# EAGLE design SNARFBASE-v03i-new232 (EAGLE 5.11)
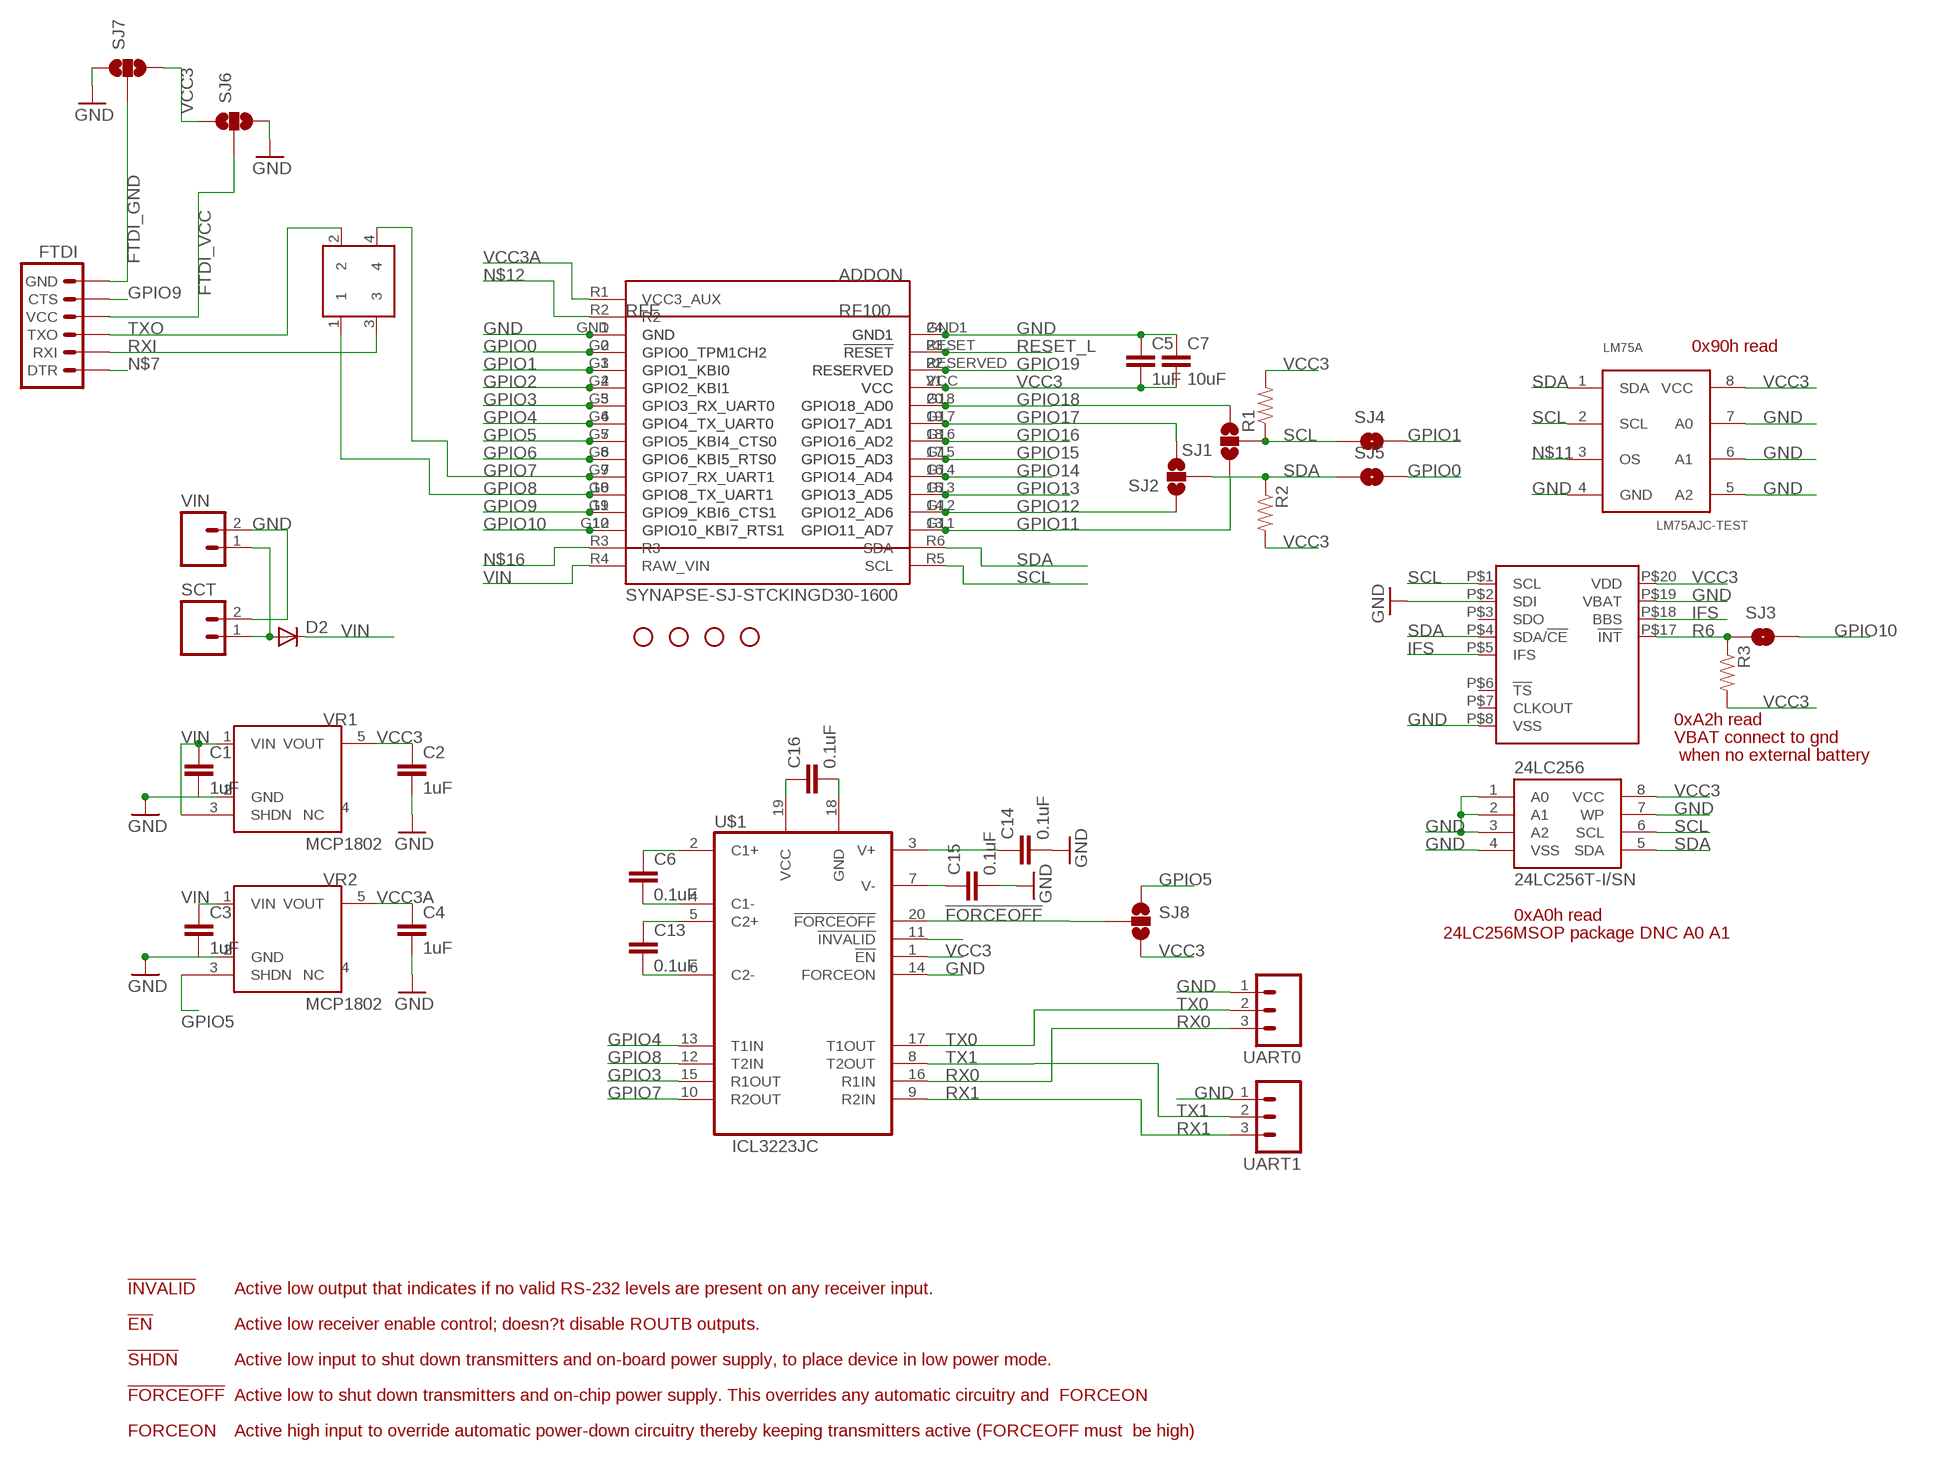
[diagram p0: schematic, sheet 1]

## Parts
24LC256  24LC256T-I/SN  EEPROM-I2CSMD  [SO08]
ADDON  SYNAPSE-SJ-STCKINGD30-1600  [SYNSJ-STACK]
C1  1uF  CAP0805  [0805]
C2  1uF  CAP0805  [0805]
C3  1uF  CAP0805  [0805]
C4  1uF  CAP0805  [0805]
C5  1uF  CAP0805  [0805]
C6  0.1uF  CAP0805  [0805]
C7  10uF  CAP0805  [0805]
C13  0.1uF  CAP0805  [0805]
C14  0.1uF  CAP0805  [0805]
C15  0.1uF  CAP0805  [0805]
C16  0.1uF  CAP0805  [0805]
D2  DIODESMA  [SMA-DIODE]
FTDI  ARDUINO_SERIAL_PROGRAMPTH  [1X06]
JP6  STAND-OFF  [STAND-OFF]
JP9  STAND-OFF  [STAND-OFF]
JP10  STAND-OFF  [STAND-OFF]
JP11  STAND-OFF  [STAND-OFF]
LM75A  LM75AJC-TEST  [TSSOP8-3MM]
PCF2129A  PCF2129ASO20  [SO20W]
R1  RESISTOR  [0805]
R2  RESISTOR  [0805]
R3  RESISTOR  [0805]
RFE  RFE  RF100-JACKJACK2  [SYNAPSERFENGINE-THM-SMT-JACK2]
RXTX  SERIAL_CROSSOVER  [2X02_PTH]
SCT  M023.5MM  [SCREWTERMINAL-3.5MM-2]
SJ1  SOLDERJUMPER_2WAYS  [SJ_3]
SJ2  SOLDERJUMPER_2WAYS  [SJ_3]
SJ3  SOLDERJUMPERNC2  [SJ_2S-NOTRACE]
SJ4  SOLDERJUMPERNO  [SJ_2S-NO]
SJ5  SOLDERJUMPERNO  [SJ_2S-NO]
SJ6  SOLDERJUMPER_2WAYPASTE1&2  [SJ_3_PASTE1&2]
SJ7  SOLDERJUMPER_2WAYPASTE1&2  [SJ_3_PASTE1&2]
SJ8  SOLDERJUMPER_2WAYPASTE1&2  [SJ_3_PASTE1&2]
U$1  ICL3223JC  [TSSOP20-JC]
UART0  M03PTH  [1X03]
UART1  M03PTH  [1X03]
VIN  M02PTH  [1X02]
VR1  MCP1802  [SOT23-5]
VR2  MCP1802  [SOT23-5]

## Nets
!FORCEOFF: SJ8.2 U$1.20(!FORCEOFF)
FTDI_GND: FTDI.6(GND) SJ7.2
FTDI_VCC: FTDI.4(VCC) SJ6.2
GND: 24LC256.1(A0) 24LC256.2(A1) 24LC256.3(A2) 24LC256.4(VSS) 24LC256.7(WP) ADDON.GND ADDON.GND1 C1.2 C2.2 C3.2 C4.2 C5.1 C7.1 C14.2 C15.2 C16.2 LM75A.4(GND) LM75A.5(A2) LM75A.6(A1) LM75A.7(A0) PCF2129A.P$2(SDI) PCF2129A.P$8(VSS) PCF2129A.P$19(VBAT) RFE.1(GND) RFE.24(GND1) RFE.P1 RFE.P24 RFE.P201 RFE.P224 SCT.2 SJ6.3 SJ7.1 U$1.14(FORCEON) U$1.18(GND) UART0.1 UART1.1 VIN.2 VR1.2(GND) VR2.2(GND)
GPIO0: ADDON.G0(GPIO0_TPM1CH2) RFE.2(GPIO0_TPM1CH2) RFE.P2 RFE.P202 SJ5.2
GPIO1: ADDON.G1(GPIO1_KBI0) RFE.3(GPIO1_KBI0) RFE.P3 RFE.P203 SJ4.2
GPIO2: ADDON.G2(GPIO2_KBI1) RFE.4(GPIO2_KBI1) RFE.P4 RFE.P204
GPIO3: ADDON.G3(GPIO3_RX_UART0) RFE.5(GPIO3_RX_UART0) RFE.P5 RFE.P205 U$1.15(R1OUT)
GPIO4: ADDON.G4(GPIO4_TX_UART0) RFE.6(GPIO4_TX_UART0) RFE.P6 RFE.P206 U$1.13(T1IN)
GPIO5: ADDON.G5(GPIO5_KBI4_CTS0) RFE.7(GPIO5_KBI4_CTS0) RFE.P7 RFE.P207 SJ8.1 VR2.3(SHDN)
GPIO6: ADDON.G6(GPIO6_KBI5_RTS0) RFE.8(GPIO6_KBI5_RTS0) RFE.P8 RFE.P208
GPIO7: ADDON.G7(GPIO7_RX_UART1) RFE.9(GPIO7_RX_UART1) RFE.P9 RFE.P209 RXTX.4 U$1.10(R2OUT)
GPIO8: ADDON.G8(GPIO8_TX_UART1) RFE.10(GPIO8_TX_UART1) RFE.P10 RFE.P210 RXTX.1 U$1.12(T2IN)
GPIO9: ADDON.G9(GPIO9_KBI6_CTS1) FTDI.5(CTS) RFE.11(GPIO9_KBI6_CTS1) RFE.P11 RFE.P211
GPIO10: ADDON.G10(GPIO10_KBI7_RTS1) RFE.12(GPIO10_KBI7_RTS1) RFE.P12 RFE.P212 SJ3.2
GPIO11: ADDON.G11(GPIO11_AD7) RFE.13(GPIO11_AD7) RFE.P13 RFE.P213 SJ1.1
GPIO12: ADDON.G12(GPIO12_AD6) RFE.14(GPIO12_AD6) RFE.P14 RFE.P214 SJ2.1
GPIO13: ADDON.G13(GPIO13_AD5) RFE.15(GPIO13_AD5) RFE.P15 RFE.P215
GPIO14: ADDON.G14(GPIO14_AD4) RFE.16(GPIO14_AD4) RFE.P16 RFE.P216
GPIO15: ADDON.G15(GPIO15_AD3) RFE.17(GPIO15_AD3) RFE.P17 RFE.P217
GPIO16: ADDON.G16(GPIO16_AD2) RFE.18(GPIO16_AD2) RFE.P18 RFE.P218
GPIO17: ADDON.G17(GPIO17_AD1) RFE.19(GPIO17_AD1) RFE.P19 RFE.P219 SJ2.3
GPIO18: ADDON.G18(GPIO18_AD0) RFE.20(GPIO18_AD0) RFE.P20 RFE.P220 SJ1.3
GPIO19: ADDON.RESERVED RFE.22(RESERVED) RFE.P22 RFE.P222
IFS: PCF2129A.P$5(IFS) PCF2129A.P$18(BBS)
N$1: C13.1 U$1.5(C2+)
N$2: C13.2 U$1.6(C2-)
N$3: C6.1 U$1.2(C1+)
N$5: C6.2 U$1.4(C1-)
N$7: FTDI.1(DTR)
N$9: C14.1 U$1.3(V+)
N$10: C15.1 U$1.7(V-)
N$11: LM75A.3(OS)
N$12: ADDON.R2
N$16: ADDON.R3
N$20: U$1.11(!INVALID)
R6: PCF2129A.P$17(!INT) R3.1 SJ3.1
RESET_L: ADDON.RESET(!RESET) RFE.23(!RESET) RFE.P23 RFE.P223
RX0: UART0.3
RX1: U$1.9(R2IN) UART1.3
RXI: FTDI.2(RXI) RXTX.3
SCL: 24LC256.6(SCL) ADDON.R5(SCL) LM75A.2(SCL) PCF2129A.P$1(SCL) R1.1 SJ1.2 SJ4.1
SDA: 24LC256.5(SDA) ADDON.R6(SDA) LM75A.1(SDA) PCF2129A.P$4(SDA/!CE) R2.1 SJ2.2 SJ5.1
TX0: U$1.17(T1OUT) UART0.2
TX1: UART1.2
TXO: FTDI.3(TXO) RXTX.2
VCC3: 24LC256.8(VCC) ADDON.VCC C2.1 C5.2 C7.2 C16.1 LM75A.8(VCC) PCF2129A.P$20(VDD) R1.2 R2.2 R3.2 RFE.21(VCC) RFE.P21 RFE.P221 SJ6.1 SJ7.3 SJ8.3 U$1.1(!EN) U$1.19(VCC) VR1.5(VOUT)
VCC3A: ADDON.R1(VCC3_AUX) C4.1 VR2.5(VOUT)
VIN: ADDON.R4(RAW_VIN) C1.1 C3.1 D2.C VR1.1(VIN) VR1.3(SHDN) VR2.1(VIN)
VIN_PREDIODE: D2.A SCT.1 VIN.1
Unconnected: PCF2129A.P$3(SDO) PCF2129A.P$6(!TS) PCF2129A.P$7(CLKOUT) U$1.8(T2OUT) U$1.16(R1IN) VR1.4(NC) VR2.4(NC)

## Notes on the sheet
- 0x90h read
- 0xA2h read
- VBAT connect to gnd
- when no external battery
- 0xA0h read
- 24LC256MSOP package DNC A0 A1
- !INVALID | Active low output that indicates if no valid RS-232 levels are present on any receiver input.
- !EN | Active low receiver enable control; doesn?t disable ROUTB outputs.
- !SHDN | Active low input to shut down transmitters and on-board power supply, to place device in low power mode.
- !FORCEOFF | Active low to shut down transmitters and on-chip power supply. This overrides any automatic circuitry and  FORCEON
- FORCEON | Active high input to override automatic power-down circuitry thereby keeping transmitters active (FORCEOFF must  be high)

## Library data of the parts
24LC256 = SparkFun:EEPROM-I2C
ADDON = 0_jc-custom:SYNAPSE-SJ-STCKING: Standard layout for expansion modules using Synapse Wireless boards
C1-C7 C13-C16 = 0_jc-custom:CAP: Capacitor Standard 0603 ceramic capacitor, and 0.1" leaded capacitor.
D2 = SparkFun:DIODE: Diode These are standard reverse protection diodes and small signal diodes. SMA package can handle up to about 1A. SOD-323 can handle about 200mA. What the SOD-323 package when ordering, there are some mfgs out there that are 5-pin packages.
FTDI = SparkFun:ARDUINO_SERIAL_PROGRAM
JP6 JP9-JP11 = SparkFun:STAND-OFF: Stand Off This is the mechanical footprint for a #4 phillips button head screw. Use the keepout ring to avoid running the screw head into surrounding components. SKU : PRT-00447
LM75A = 0_jc-custom:LM75A
PCF2129A = 0_jc-custom:PCF2129A
R1-R3 = SparkFun:RESISTOR: Resistor Basic schematic elements and footprints for 0603, 1206, and PTH 1/10th watt (small) resistors.
RFE = 0_jc-custom:RF100-JACK
RXTX = 0_jc-custom:SERIAL_CROSSOVER
SCT VIN = SparkFun:M02: Header 2 Standard 2-pin 0.1" header. Use with straight break away headers (SKU : PRT-00116), right angle break away headers (PRT-00553), swiss pins (PRT-00743), machine pins (PRT-00117), and female headers (PRT-00115). Molex polarized connector foot print use with SKU : PRT-08233 with associated crimp pins and housings.
SJ1 SJ2 SJ6-SJ8 = SparkFun:SOLDERJUMPER_2WAY: Solder Jumper 2 way solder jumper
SJ3-SJ5 = SparkFun:SOLDERJUMPER: Solder Jumper Standard SMD solder jumper. Used to automate production. Two varients : Normally Open and Normally Closed are the same, but have different paste layers. NC will have a large amount of paste and should jumper during reflow.
U$1 = 0_jc-custom:ICL3223
UART0 UART1 = SparkFun:M03: Header 3 Standard 3-pin 0.1" header. Use with straight break away headers (SKU : PRT-00116), right angle break away headers (PRT-00553), swiss pins (PRT-00743), machine pins (PRT-00117), and female headers (PRT-00115). Molex polarized connector foot print use with SKU : PRT-08232 with associated crimp pins and housings.
VR1 VR2 = 0_jc-custom:MCP1802

## Net classes
0 default: width 0.254 mm
1 Power: width 0.508 mm
2 smallsignal: width 0.152 mm
3 stdsignal: width 0.254 mm

## Board
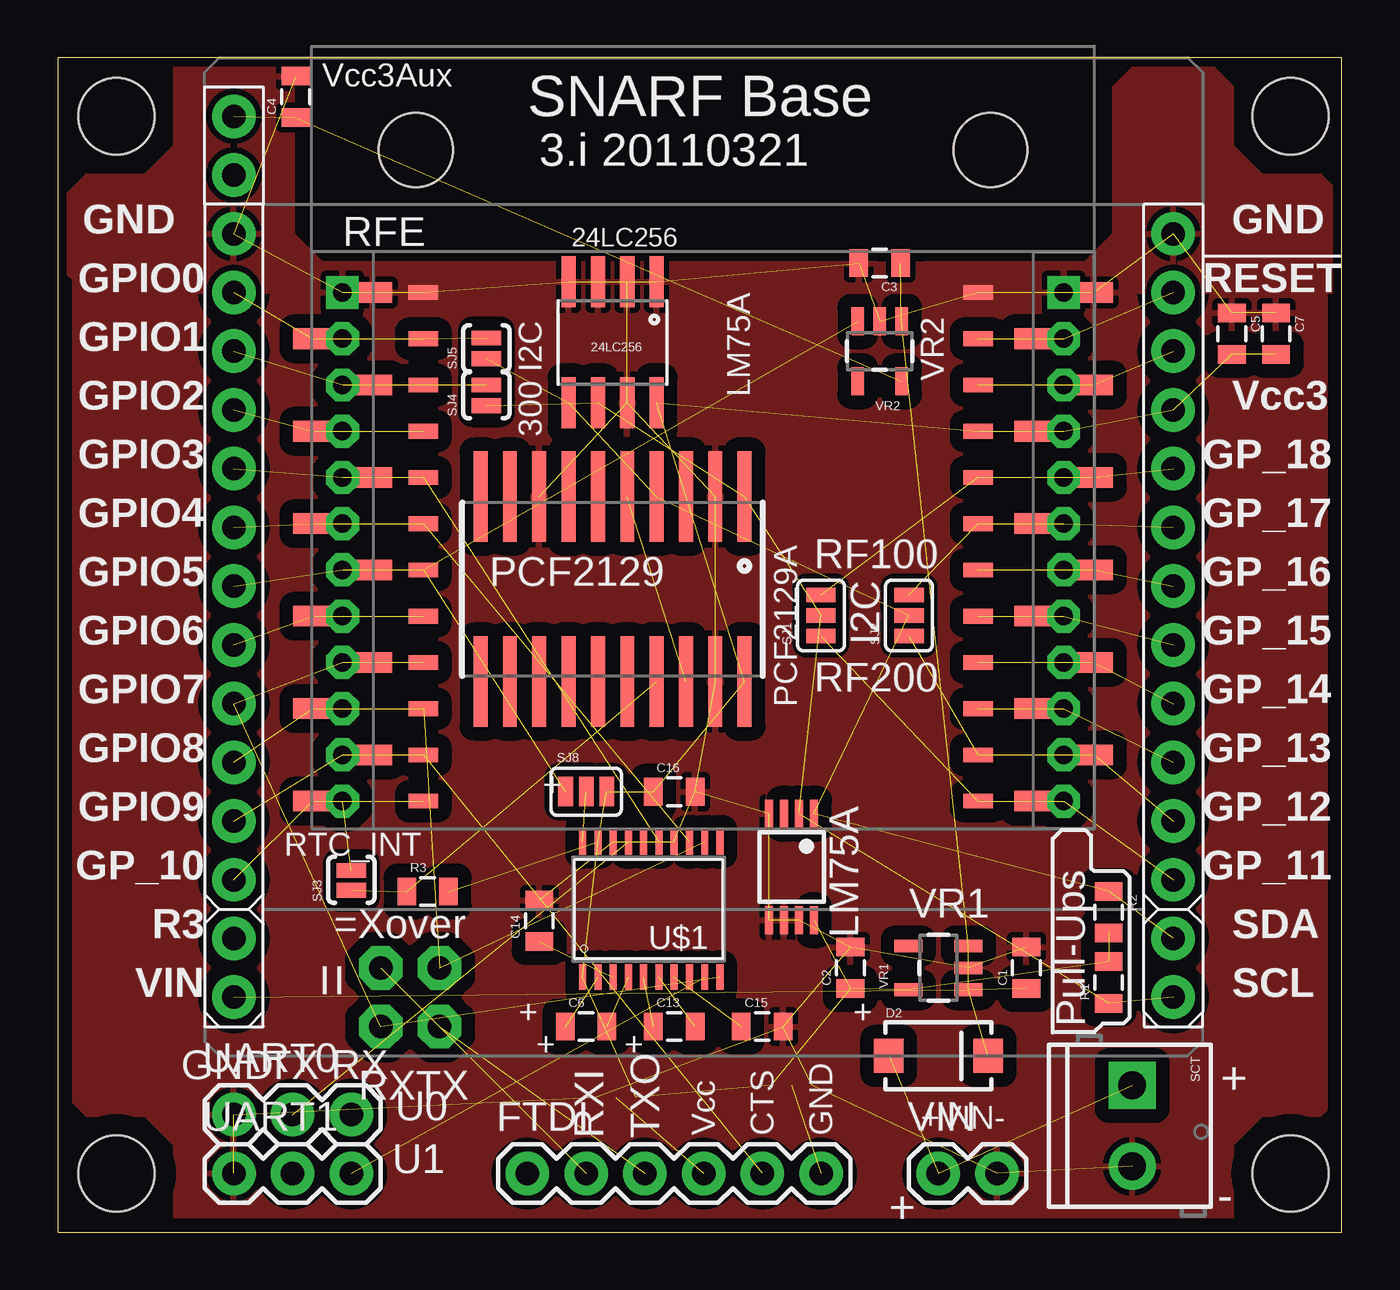
[diagram p1: board, top side]
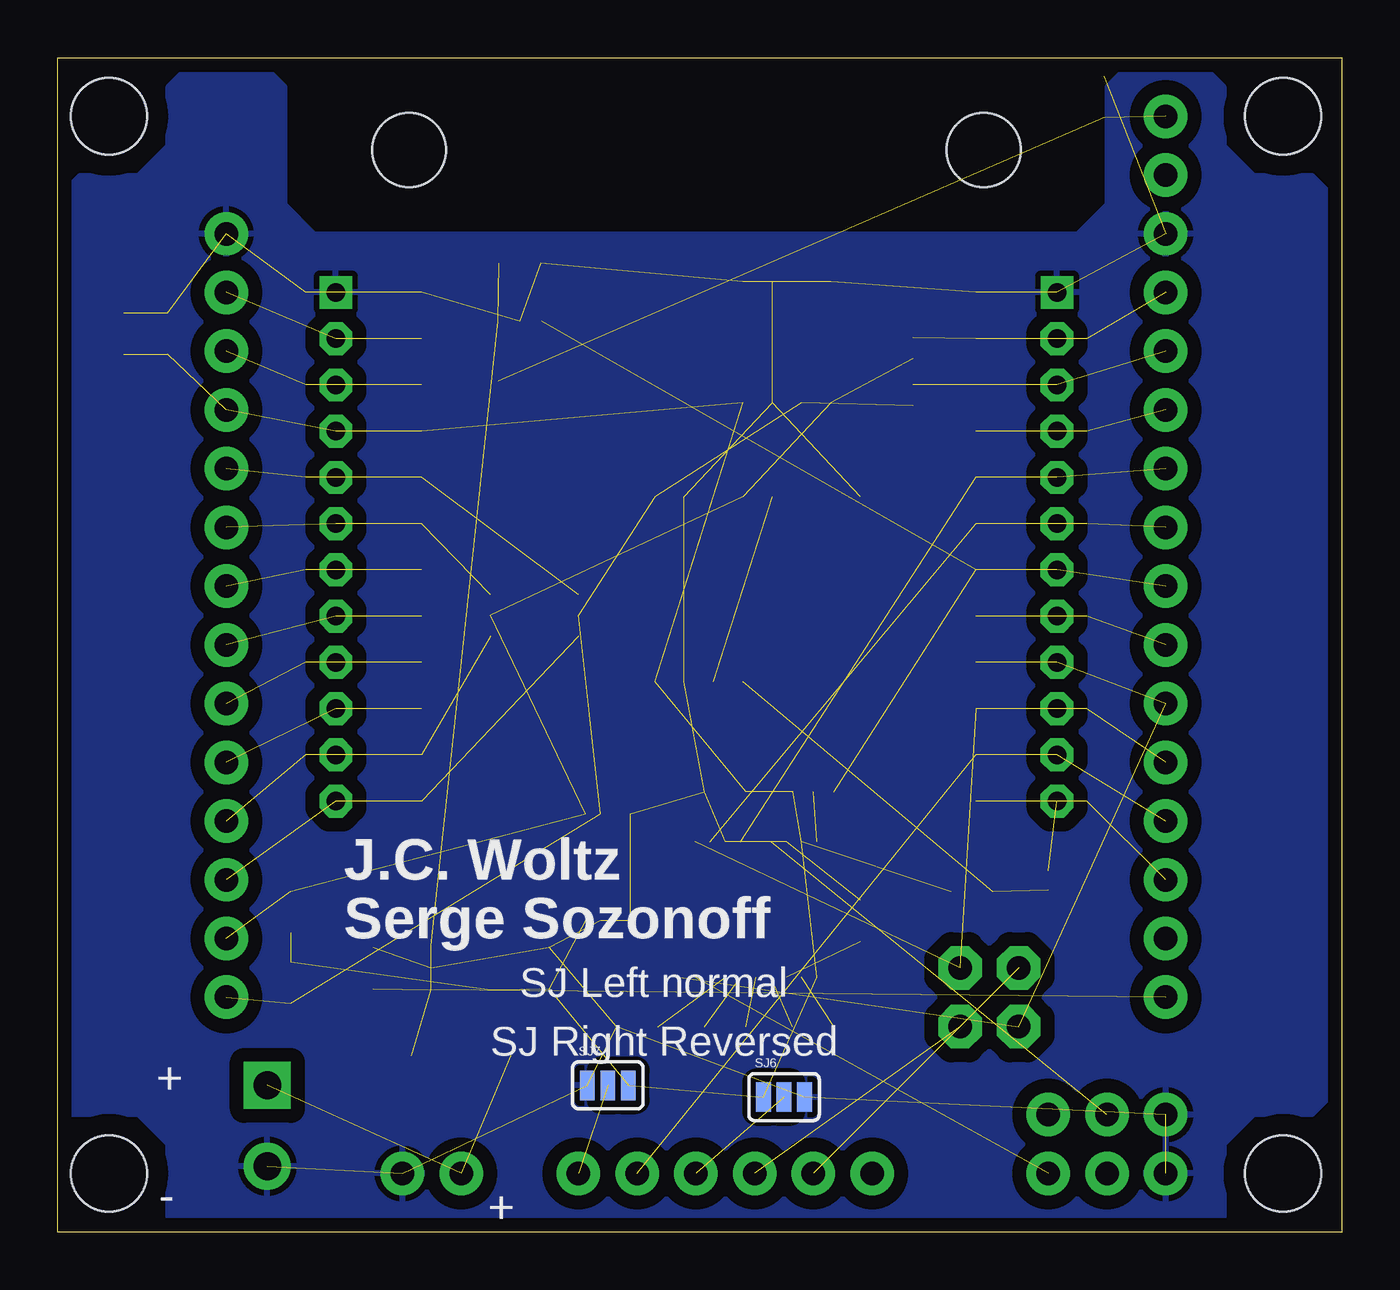
[diagram p2: board, bottom side, seen from below]

Size 55.55 x 50.79 mm. Coordinates in mm from the lower left corner, seen from the top.
Outline: 0,0 55.55,0 55.55,50.79 0,50.79 0,0
Copper layers (1*16): Top 0.0356mm / dielectric 1.5011mm / Bottom 0.0356mm
Design rules "LaenPCBOrder-JCModified": minimum track width 6mil, minimum drill 13mil, track to track 6mil, track to pad 6mil, pad to pad 6mil, via to via 6mil, smd to smd 6mil, copper to edge 15mil, drill to drill 6mil, minimum pad ring 12mil, minimum via ring 7mil, stop-mask expansion 4mil, vias tented up to drill 25mil, thermal gap 10mil

### Footprints (pad centres in the part's own frame; a part is rotated, then mirrored left to right if it is on the bottom)
SO08 = smd 0.61 x 2.21: 1 -1.905,-2.616; 2 -0.635,-2.616; 3 0.635,-2.616; 4 1.905,-2.616; 5 1.905,2.616; 6 0.635,2.616; 7 -0.635,2.616; 8 -1.905,2.616
SYNSJ-STACK = drill 1.016 pad 1.88 round: G0 0,-7.62; G1 0,-10.16; G2 0,-12.7; G3 0,-15.24; G4 0,-17.78; G5 0,-20.32; G6 0,-22.86; G7 0,-25.4; G8 0,-27.94; G9 0,-30.48; G10 0,-33.02; G11 40.64,-33.02; G12 40.64,-30.48; G13 40.64,-27.94; G14 40.64,-25.4; G15 40.64,-22.86; G16 40.64,-20.32; G17 40.64,-17.78; G18 40.64,-15.24; GND 0,-5.08; GND1 40.64,-5.08; R1 0,0; R2 0,-2.54; R3 0,-35.56; R4 0,-38.1; R5 40.64,-38.1; R6 40.64,-35.56; RESERVED 40.64,-10.16; RESET 40.64,-7.62; VCC 40.64,-12.7
0805 = smd 0.8 x 1.2: 1 -0.9,0; 2 0.9,0
SMA-DIODE = smd 1.27 x 1.47: A -2.15,0; C 2.15,0
1X06 = drill 1.016 pad 1.88 round: 1 0,0; 2 2.54,0; 3 5.08,0; 4 7.62,0; 5 10.16,0; 6 12.7,0
STAND-OFF = hole 3.302: 0,0
TSSOP8-3MM = smd 1.2 x 0.35: 1 -2.6,0.975; 2 -2.6,0.325; 3 -2.6,-0.325; 4 -2.6,-0.975; 5 2,-0.975; 6 2,-0.325; 7 2,0.325; 8 2,0.975
SO20W = smd 0.6 x 3.9: P$1 -5.715,-4; P$2 -4.445,-4; P$3 -3.175,-4; P$4 -1.905,-4; P$5 -0.635,-4; P$6 0.635,-4; P$7 1.905,-4; P$8 3.175,-4; P$9 4.445,-4; P$10 5.715,-4; P$11 5.715,4; P$12 4.445,4; P$13 3.175,4; P$14 1.905,4; P$15 0.635,4; P$16 -0.635,4; P$17 -1.905,4; P$18 -3.175,4; P$19 -4.445,4; P$20 -5.715,4
SYNAPSERFENGINE-THM-SMT-JACK2 = drill 0.8 square: 1 0,0; 24 31.2,0 | drill 0.8 pad 1.422 octagon: 2 0,-2; 3 0,-4; 4 0,-6; 5 0,-8; 6 0,-10; 7 0,-12; 8 0,-14; 9 0,-16; 10 0,-18; 11 0,-20; 12 0,-22; 13 31.2,-22; 14 31.2,-20; 15 31.2,-18; 16 31.2,-16; 17 31.2,-14; 18 31.2,-12; 19 31.2,-10; 20 31.2,-8; 21 31.2,-6; 22 31.2,-4; 23 31.2,-2 | smd 1.67 x 0.89: P1 1.3,0; P2 -1.3,-2; P3 1.3,-4; P4 -1.3,-6; P5 1.3,-8; P6 -1.3,-10; P7 1.3,-12; P8 -1.3,-14; P9 1.3,-16; P10 -1.3,-18; P11 1.3,-20; P12 -1.3,-22; P13 29.9,-22; P14 32.5,-20; P15 29.9,-18; P16 32.5,-16; P17 29.9,-14; P18 32.5,-12; P19 29.9,-10; P20 32.5,-8; P21 29.9,-6; P22 32.5,-4; P23 29.9,-2; P24 32.5,0 | smd 1.27 x 0.635: P201 3.5,0; P202 3.5,-2; P203 3.5,-4; P204 3.5,-6; P205 3.5,-8; P206 3.5,-10; P207 3.5,-12; P208 3.5,-14; P209 3.5,-16; P210 3.5,-18; P211 3.5,-20; P212 3.5,-22; P213 27.5,-22; P214 27.5,-20; P215 27.5,-18; P216 27.5,-16; P217 27.5,-14; P218 27.5,-12; P219 27.5,-10; P220 27.5,-8; P221 27.5,-6; P222 27.5,-4; P223 27.5,-2; P224 27.5,0 | hole 3.2: 3.17,6.16; 28.03,6.16
2X02_PTH = drill 1.016 pad 1.88 octagon: 1 -1.27,-1.27; 2 -1.27,1.27; 3 1.27,-1.27; 4 1.27,1.27
SCREWTERMINAL-3.5MM-2 = drill 1.2 pad 2.032 square: 1 0,0 | drill 1.2 pad 2.032 round: 2 3.5,0
SJ_3 = smd 0.635 x 1.27: 1 -0.889,0; 2 0,0; 3 0.889,0
SJ_2S-NOTRACE = smd 0.635 x 1.27: 1 -0.45,0; 2 0.4,0
SJ_2S-NO = smd 0.635 x 1.27: 1 -0.45,0; 2 0.45,0
SJ_3_PASTE1&2 = smd 0.635 x 1.27: 1 -0.889,0; 2 0,0; 3 0.889,0
TSSOP20-JC = smd 1.1 x 0.3: 1 -2.937,2.693; 2 -2.937,2.032; 3 -2.937,1.372; 4 -2.937,0.712; 5 -2.937,0.051; 6 -2.937,-0.609; 7 -2.937,-1.27; 8 -2.943,-1.93; 9 -2.937,-2.59; 10 -2.937,-3.251; 11 2.905,-3.251; 12 2.905,-2.59; 13 2.911,-1.93; 14 2.905,-1.27; 15 2.905,-0.609; 16 2.905,0.051; 17 2.905,0.712; 18 2.905,1.372; 19 2.905,2.032; 20 2.905,2.693
1X03 = drill 1.016 pad 1.88 round: 1 0,0; 2 2.54,0; 3 5.08,0
1X02 = drill 1.016 pad 1.88 round: 1 0,0; 2 2.54,0
SOT23-5 = smd 0.55 x 1.2: 1 -0.95,-1.3; 2 0,-1.3; 3 0.95,-1.3; 4 0.95,1.3; 5 -0.95,1.3

### Placement (x,y rotation side)
24LC256  24,38.48 180 top
ADDON  7.62,48.26 0 top
C1  41.91,11.43 90 top
C2  34.29,11.43 90 top
C3  35.56,41.91 180 top
C4  10.29,49.1 90 top
C5  50.8,38.86 270 top
C6  22.86,8.89 0 top
C7  52.7,38.86 270 top
C13  26.67,8.89 0 top
C14  20.83,13.46 90 top
C15  30.48,8.89 0 top
C16  26.67,19.05 0 top
D2  38.1,7.62 0 top
FTDI  20.32,2.54 0 top
JP6  53.34,2.54 0 top
JP9  2.54,2.54 0 top
JP10  53.34,48.26 0 top
JP11  2.54,48.26 0 top
LM75A  31.75,15.49 270 top
PCF2129A  24,27.81 180 top
R1  45.47,10.79 90 top
R2  45.47,13.84 270 top
R3  16,14.73 0 top
RFE  12.32,40.64 0 top
RXTX  15.24,10.16 180 top
SCT  46.48,6.35 270 top
SJ1  33.02,26.67 90 top
SJ2  36.83,26.67 90 top
SJ3  12.7,15.24 90 top
SJ4  18.54,36.2 90 top
SJ5  18.54,38.23 90 top
SJ6  24.13,5.84 0 bottom
SJ7  31.75,6.35 0 bottom
SJ8  22.86,19.05 0 top
U$1  25.4,13.97 90 top
UART0  7.62,5.08 0 top
UART1  7.62,2.54 0 top
VIN  38.1,2.54 0 top
VR1  38.1,11.43 90 top
VR2  35.56,38.1 180 top

### Tracks (layer width: path | path; a pad name or v marks a point on that pad's centre or on a via)
!FORCEOFF  (1 unrouted)
FTDI_GND  (1 unrouted)
FTDI_VCC  (1 unrouted)
GND  (38 unrouted)
  pour Top (isolate 0.61): 0,41.91 0,6.35 1.27,5.08 3.81,5.08 5.08,3.81 5.08,0 50.8,0 50.8,3.81 52.07,5.08 54.61,5.08 55.88,6.35 55.88,41.91
  pour Top (isolate 0.254): 0,41.91 0,44.45 1.27,45.72 3.81,45.72 5.08,46.99 5.08,50.8 8.89,50.8 10.16,49.53 10.16,43.18 11.43,41.91 44.45,41.91 45.72,43.18 45.72,49.53 46.99,50.8 49.53,50.8 50.8,49.53 50.8,46.99 52.07,45.72 54.61,45.72 55.88,44.45 55.88,40.64 1.27,40.64
  pour Bottom (isolate 0.61): 0,44.45 0,6.35 1.27,5.08 3.81,5.08 5.08,3.81 5.08,0 50.8,0 50.8,3.81 52.07,5.08 55.88,5.08 55.88,44.45 54.61,45.72 52.07,45.72 50.8,46.99 50.8,49.53 49.53,50.8 46.99,50.8 45.72,49.53 45.72,44.45 44.45,43.18 11.43,43.18 10.16,44.45 10.16,49.53 8.89,50.8 6.35,50.8 5.08,49.53 5.08,46.99 3.81,45.72 1.27,45.72
GPIO0  (4 unrouted)
GPIO1  (4 unrouted)
GPIO2  (3 unrouted)
GPIO3  (4 unrouted)
GPIO4  (4 unrouted)
GPIO5  (5 unrouted)
GPIO6  (3 unrouted)
GPIO7  (5 unrouted)
GPIO8  (5 unrouted)
GPIO9  (4 unrouted)
GPIO10  (4 unrouted)
GPIO11  (4 unrouted)
GPIO12  (4 unrouted)
GPIO13  (3 unrouted)
GPIO14  (3 unrouted)
GPIO15  (3 unrouted)
GPIO16  (3 unrouted)
GPIO17  (4 unrouted)
GPIO18  (4 unrouted)
GPIO19  (3 unrouted)
IFS  (1 unrouted)
N$1  (1 unrouted)
N$2  (1 unrouted)
N$3  (1 unrouted)
N$5  (1 unrouted)
N$9  (1 unrouted)
N$10  (1 unrouted)
R6  (2 unrouted)
RESET_L  (3 unrouted)
RX1  (1 unrouted)
RXI  (1 unrouted)
SCL  (6 unrouted)
SDA  (6 unrouted)
TX0  (1 unrouted)
TXO  (1 unrouted)
VCC3  (19 unrouted)
VCC3A  (2 unrouted)
VIN  (6 unrouted)
VIN_PREDIODE  (2 unrouted)

### Text on the board
tPlace: Vcc3Aux | SNARF Base | 3.i 20110321 | GND | 24LC256 | GND | GPIO0 | LM75A | !RESET | GPIO1 | GPIO2 | VR2 | Vcc3 | GPIO3 | 300 I2C | GP_18 | GPIO4 | RF100 | GP_17 | GPIO5 | PCF2129 | GP_16 | GPIO6 | I2C | RF200 | GP_15 | GPIO7 | GP_14 | GPIO8 | GP_13 | GPIO9 | + | GP_12 | GP_10 | RTC_INT | GP_11 | R3 | VR1 | =Xover | SDA | VIN | = | SCL | + | + | Pull-Ups | + | + | GND | TX | RX | + | U0 | RXI | TXO | Vcc | CTS | GND | +VIN- | U1 | - | +
bPlace: J.C. Woltz | Serge Sozonoff | SJ Left normal | SJ Right Reversed | + | - | +